# Altium project PICR22-team-Teletupsud.PrjPcb
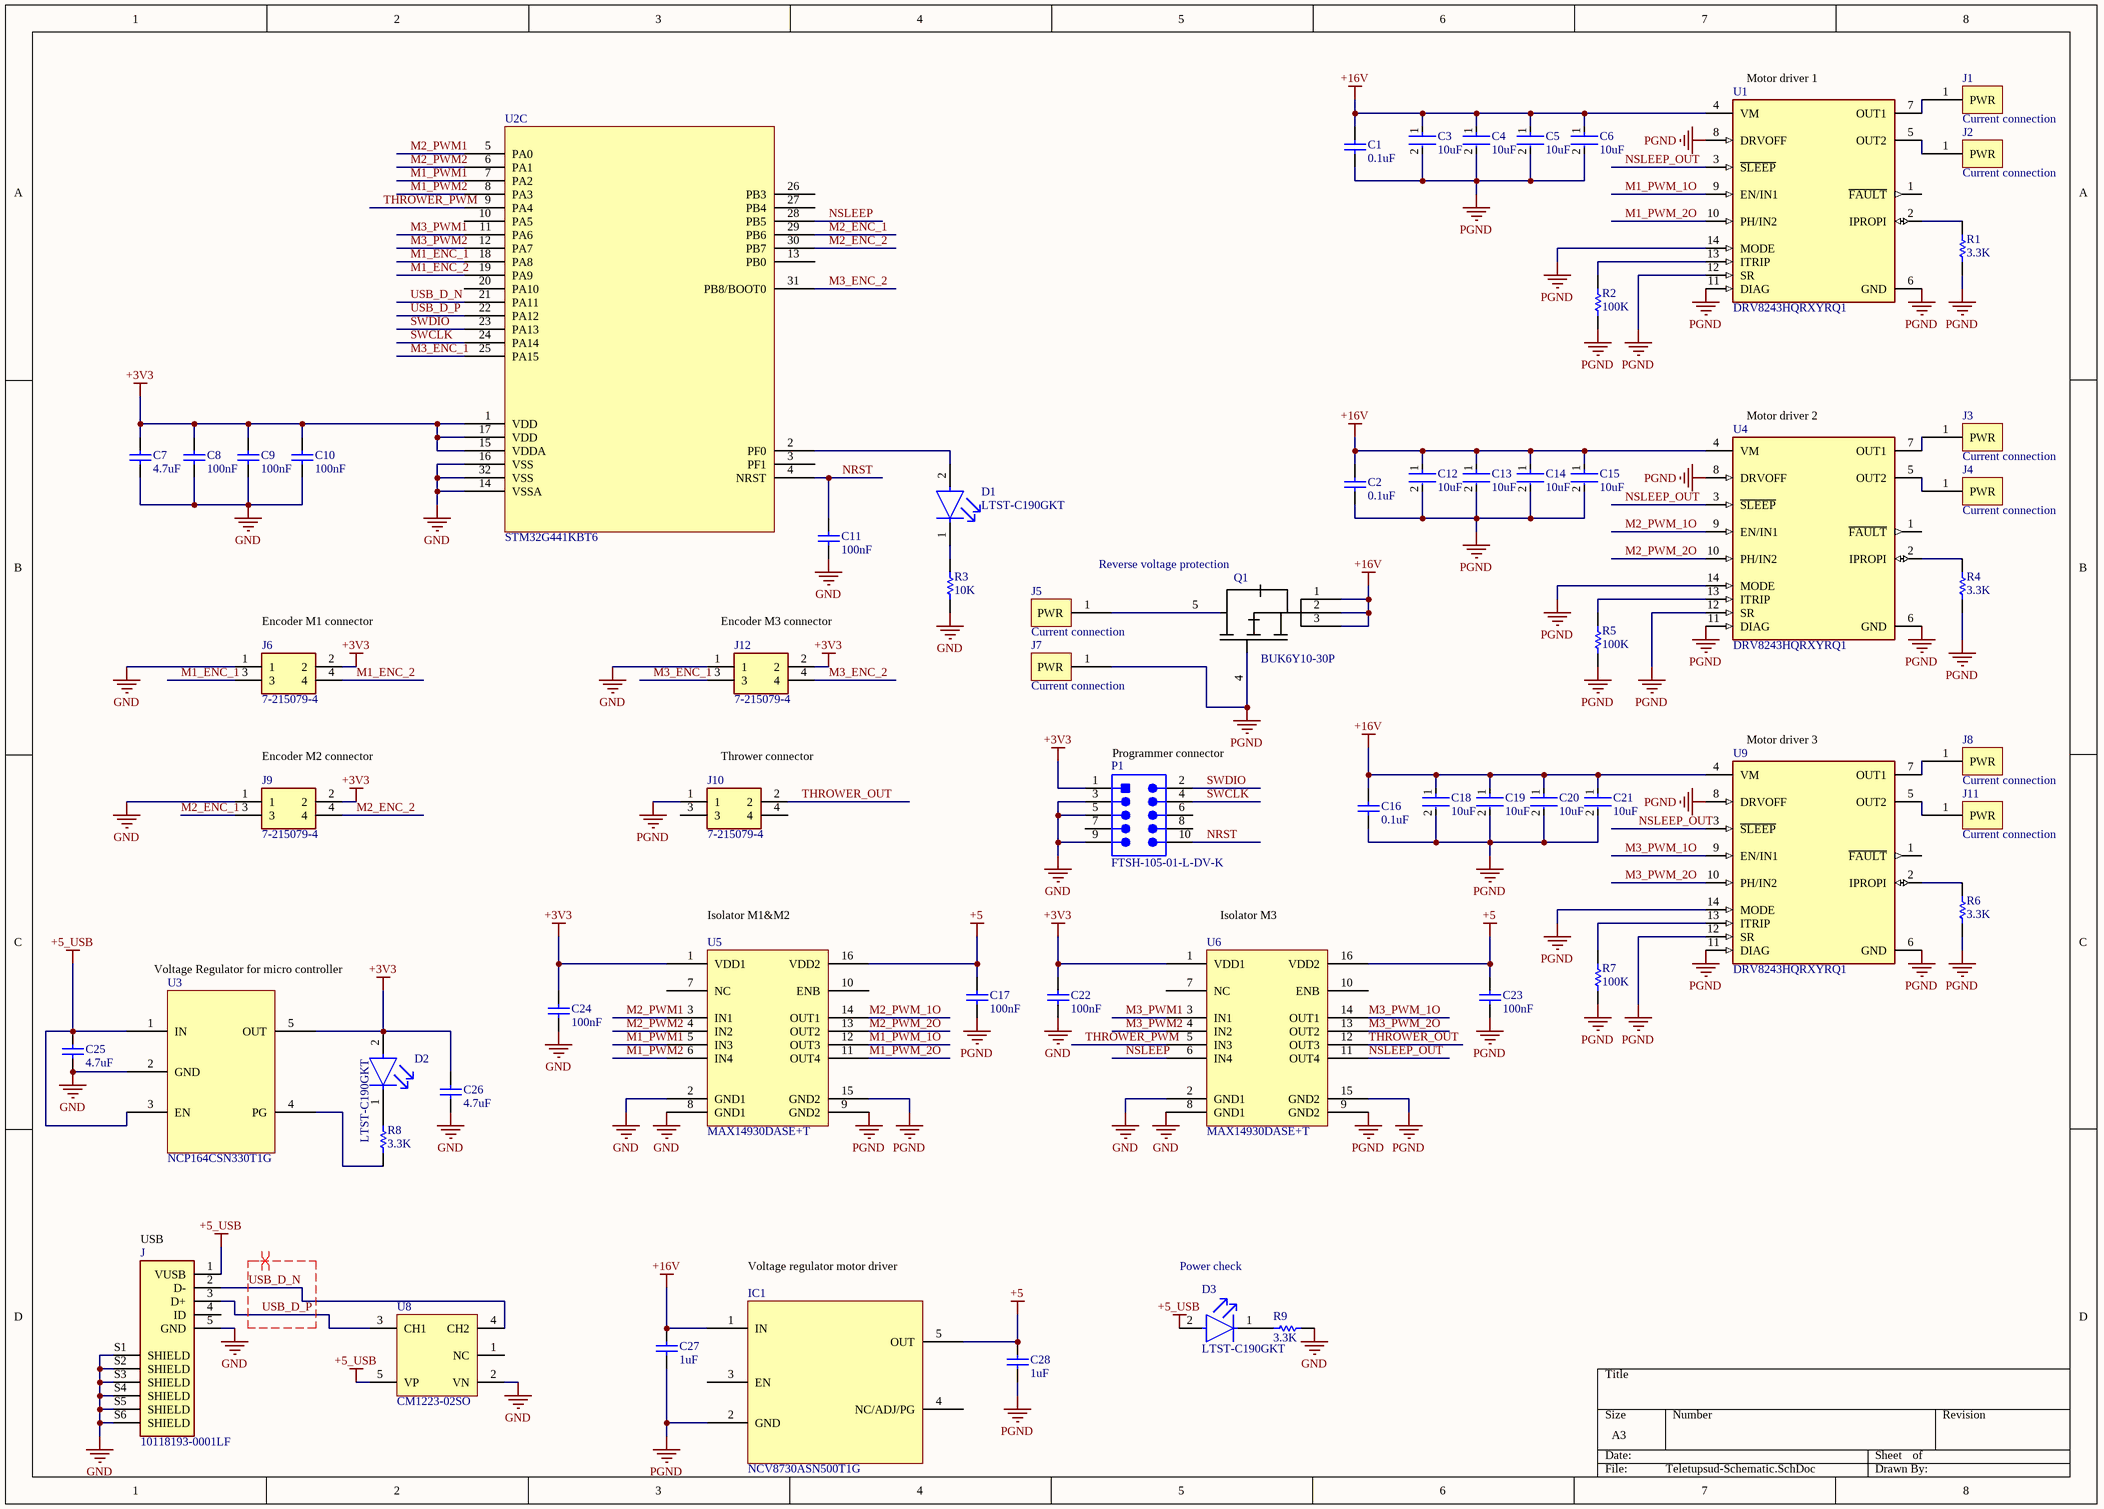
[diagram p0: Teletupsud-Schematic.SchDoc]
1 sheet, 64 parts. Net scope: global (net labels, ports and power ports of the same name join across sheets).

## Sheet Teletupsud-Schematic.SchDoc
size A3; SheetNumber: 1; SheetTotal: 1

### Parts
C1  0.1uF  [CAPC1608X90X35ML10T15]
C2  0.1uF  [CAPC1608X90X35ML10T15]
C3  10uF  [FP-GRM21B-0_15-IPC_A]
C4  10uF  [FP-GRM21B-0_15-IPC_A]
C5  10uF  [FP-GRM21B-0_15-IPC_A]
C6  10uF  [FP-GRM21B-0_15-IPC_A]
C7  4.7uF  [CAPC1608X90X35ML10T15]
C8  100nF  [CAPC1608X90X35ML10T15]
C9  100nF  [CAPC1608X90X35ML10T15]
C10  100nF  [CAPC1608X90X35ML10T15]
C11  100nF  [CAPC1608X90X35ML10T15]
C12  10uF  [FP-GRM21B-0_15-IPC_A]
C13  10uF  [FP-GRM21B-0_15-IPC_A]
C14  10uF  [FP-GRM21B-0_15-IPC_A]
C15  10uF  [FP-GRM21B-0_15-IPC_A]
C16  0.1uF  [CAPC1608X90X35ML10T15]
C17  100nF  [CAPC1608X90X35ML10T15]
C18  10uF  [FP-GRM21B-0_15-IPC_A]
C19  10uF  [FP-GRM21B-0_15-IPC_A]
C20  10uF  [FP-GRM21B-0_15-IPC_A]
C21  10uF  [FP-GRM21B-0_15-IPC_A]
C22  100nF  [CAPC1608X90X35ML10T15]
C23  100nF  [CAPC1608X90X35ML10T15]
C24  100nF  [CAPC1608X90X35ML10T15]
C25  4.7uF  [CAPC1608X90X35ML10T15]
C26  4.7uF  [CAPC1608X90X35ML10T15]
C27  1uF  [CAPC1608X90X35ML10T15]
C28  1uF  [CAPC1608X90X35ML10T15]
D1  LTST-C190GKT  [FP-LTST-C190GKT-MFG]
D2  LTST-C190GKT  [FP-LTST-C190GKT-MFG]
D3  LTST-C190GKT  [FP-LTST-C190GKT-MFG]
IC1  NCV8730ASN500T1G  [SOP95P275X110-5N]
J  10118193-0001LF  [FCI_10118193-0001LF]
J1  Current connection  [New footprint 1]
J2  Current connection  [New footprint 1]
J3  Current connection  [New footprint 1]
J4  Current connection  [New footprint 1]
J5  Current connection  [New footprint 1]
J6  7-215079-4  [TE_7-215079-4]
J7  Current connection  [New footprint 1]
J8  Current connection  [New footprint 1]
J9  7-215079-4  [TE_7-215079-4]
J10  7-215079-4  [TE_7-215079-4]
J11  Current connection  [New footprint 1]
J12  7-215079-4  [TE_7-215079-4]
P1  FTSH-105-01-L-DV-K  [SMTC-FTSH-105-01-L-DV-K_V]
Q1  BUK6Y10-30P  [TO127P600X120-5N]
R1  3.3K  [RESC1609X50X30NL8T20]
R2  100K  [RESC1609X50X30NL8T20]
R3  10K  [RESC1609X50X30NL8T20]
R4  3.3K  [RESC1609X50X30NL8T20]
R5  100K  [RESC1609X50X30NL8T20]
R6  3.3K  [RESC1609X50X30NL8T20]
R7  100K  [RESC1609X50X30NL8T20]
R8  3.3K  [RESC1609X50X30NL8T20]
R9  3.3K  [RESC1609X50X30NL8T20]
U1  DRV8243HQRXYRQ1  [FP-RXY0014A-MFG]
U2  STM32G441KBT6  [QFP32_STM32]  (part C of 3)
U3  NCP164CSN330T1G  [SOP95P275X110-5N]
U4  DRV8243HQRXYRQ1  [FP-RXY0014A-MFG]
U5  MAX14930DASE+T  [SOIC127P600X175-16N]
U6  MAX14930DASE+T  [SOIC127P600X175-16N]
U8  CM1223-02SO  [ONSC-SOT23-5-527AH-01_L]
U9  DRV8243HQRXYRQ1  [FP-RXY0014A-MFG]

### Nets
+3V3: C7.2 C8.2 C9.2 C10.2 C22.2 C24.2 C26.2 D2.2(A) J6.2 J9.2 J12.2 P1.1 U2.1(VDD) U2.15(VDDA) U2.17(VDD) U3.5(OUT) U5.1(VDD1) U6.1(VDD1)
+5: C17.2 C23.2 C28.2 IC1.5(OUT) U5.16(VDD2) U6.16(VDD2)
+5_USB: C25.2 D3.2(A) J.1(VUSB) U3.1(IN) U3.3(EN) U8.5(VP)
+16V: C1.2 C2.2 C3.1 C4.1 C5.1 C6.1 C12.1 C13.1 C14.1 C15.1 C16.2 C18.1 C19.1 C20.1 C21.1 C27.2 IC1.1(IN) Q1.1 Q1.2 Q1.3 U1.4(VM) U4.4(VM) U9.4(VM)
GND: C7.1 C8.1 C9.1 C10.1 C11.1 C22.1 C24.1 C25.1 C26.1 J.5(GND) J.S1(SHIELD) J.S2(SHIELD) J.S3(SHIELD) J.S4(SHIELD) J.S5(SHIELD) J.S6(SHIELD) J6.1 J9.1 J12.1 P1.3 P1.5 P1.9 R3.1 R9.2 U2.14(VSSA) U2.16(VSS) U2.32(VSS) U3.2(GND) U5.2(GND1) U5.8(GND1) U6.2(GND1) U6.8(GND1) U8.2(VN)
PGND: C1.1 C2.1 C3.2 C4.2 C5.2 C6.2 C12.2 C13.2 C14.2 C15.2 C16.1 C17.1 C18.2 C19.2 C20.2 C21.2 C23.1 C27.1 C28.1 IC1.2(GND) J7.1(PWR) J10.1 Q1.4 R1.1 R2.1 R4.1 R5.1 R6.1 R7.1 U1.6(GND) U1.8(DRVOFF) U1.11(DIAG) U1.12(SR) U1.14(MODE) U4.6(GND) U4.8(DRVOFF) U4.11(DIAG) U4.12(SR) U4.14(MODE) U5.9(GND2) U5.15(GND2) U6.9(GND2) U6.15(GND2) U9.6(GND) U9.8(DRVOFF) U9.11(DIAG) U9.12(SR) U9.14(MODE)
M1_ENC_1: J6.3 U2.18(PA8)
M1_ENC_2: J6.4 U2.19(PA9)
M1_PWM1: U2.7(PA2) U5.5(IN3)
M1_PWM2: U2.8(PA3) U5.6(IN4)
M1_PWM_1O: U1.9(EN/IN1) U5.12(OUT3)
M1_PWM_2O: U1.10(PH/IN2) U5.11(OUT4)
M2_ENC_1: J9.3 U2.29(PB6)
M2_ENC_2: J9.4 U2.30(PB7)
M2_PWM1: U2.5(PA0) U5.3(IN1)
M2_PWM2: U2.6(PA1) U5.4(IN2)
M2_PWM_1O: U4.9(EN/IN1) U5.14(OUT1)
M2_PWM_2O: U4.10(PH/IN2) U5.13(OUT2)
M3_ENC_1: J12.3 U2.25(PA15)
M3_ENC_2: J12.4 U2.31(PB8/BOOT0)
M3_PWM1: U2.11(PA6) U6.3(IN1)
M3_PWM2: U2.12(PA7) U6.4(IN2)
M3_PWM_1O: U6.14(OUT1) U9.9(EN/IN1)
M3_PWM_2O: U6.13(OUT2) U9.10(PH/IN2)
NRST: C11.2 P1.10 U2.4(NRST)
NSLEEP: U2.28(PB5) U6.6(IN4)
NSLEEP_OUT: U1.3(~{SLEEP}) U4.3(~{SLEEP}) U6.11(OUT4) U9.3(~{SLEEP})
SWCLK: P1.4 U2.24(PA14)
SWDIO: P1.2 U2.23(PA13)
THROWER_OUT: J10.2 U6.12(OUT3)
THROWER_PWM: U2.9(PA4) U6.5(IN3)
USB_D_N: J.2(D-) U2.21(PA11) U8.4(CH2)
USB_D_P: J.3(D+) U2.22(PA12) U8.3(CH1)
NetD1_1: D1.1(C) R3.2
NetD1_2: D1.2(A) U2.2(PF0)
NetD2_1: D2.1(C) R8.2
NetD3_1: D3.1(C) R9.1
NetJ1_1: J1.1(PWR) U1.7(OUT1)
NetJ2_1: J2.1(PWR) U1.5(OUT2)
NetJ3_1: J3.1(PWR) U4.7(OUT1)
NetJ4_1: J4.1(PWR) U4.5(OUT2)
NetJ5_1: J5.1(PWR) Q1.5
NetJ8_1: J8.1(PWR) U9.7(OUT1)
NetJ11_1: J11.1(PWR) U9.5(OUT2)
NetR1_2: R1.2 U1.2(IPROPI)
NetR2_2: R2.2 U1.13(ITRIP)
NetR4_2: R4.2 U4.2(IPROPI)
NetR5_2: R5.2 U4.13(ITRIP)
NetR6_2: R6.2 U9.2(IPROPI)
NetR7_2: R7.2 U9.13(ITRIP)
NetR8_1: R8.1 U3.4(PG)

Not connected (* = marked no-connect by the designer): IC1 3(EN) 4(NC/ADJ/PG); J 4(ID); J10 3 4; P1 6 7 8; U1 1(~{FAULT}); U2 3(PF1) 10(PA5) 13(PB0) 20(PA10) 26(PB3) 27(PB4); U4 1(~{FAULT}); U5 7(NC) 10(ENB); U6 7(NC) 10(ENB); U8 1(NC); U9 1(~{FAULT})

### Layout directives
differential pair; differential pair class USB: USB_D_N, USB_D_P

### Notes on the sheet
- (near U1) Motor driver 1
- (near U4) Motor driver 2
- (near Q1) Reverse voltage protection
- (near J6) Encoder M1 connector
- (near J12) Encoder M3 connector
- (near J9) Encoder M2 connector
- (near J10) Thrower connector
- (near P1) Programmer connector
- (near U9) Motor driver 3
- (near U5) Isolator M1&M2
- (near U6) Isolator M3
- Voltage Regulator for micro controller
- (near J) USB
- Voltage regulator motor driver
- Power check

### Library data of the parts
C1 C2 C7-C11 C16 C17 C22-C28 = CMP-2000-04945-1: Chip Capacitor, 22 pF, +/- 5%, 50 V, -55 to 125 degC, 0603 (1608 Metric), RoHS, Tape and Reel; Manufacturer: Murata; Capacitance: 22pF; Rated Voltage: 50V; Dielectric: C0G; Manufacturer URL: http://www.murata.com/; Datasheet Version: Jul-06; Package Reference: 603; Tolerance (%): ±5%; Case Size/Dimension: 0603; Package Description: 2-Pin Surface Mount Device, Body 1.6 x 0.8 mm; Datasheet URL: https://datasheet.ciiva.com/11786/0900766b807a1cab-11786398.pdf
C3-C6 C12-C15 C18-C21 = CMP-00007-1: CAP CER 10UF 25V X5R 0805; Material: Ceramic; Tolerance: 10%; Reach SVHC Compliant: Yes; Construction: Flat; Mount: Surface Mount; Case Code (Metric): 2012; Capacitance: 10uF; Voltage Rating: 25V; Voltage Rating (DC): 25V; Lead Free: Lead Free; Radiation Hardening: No; Packaging: Tape and Reel; Case/Package: 0805; Depth: 1.25mm; Case Code (Imperial): 0805; Voltage: 25V; Package Quantity: 1; Thickness: 0.053inch; Height: 1.25mm; Dielectric: X5R; Termination: SMD/SMT; RoHS Compliant: Yes; Length: 2mm; Width: 0.049inch; Series: GRM; Max Operating Temperature: 85°C; Min Operating Temperature: -55°C
D1 D2 = CMP-00006-1: LED Uni-Color Green 565nm 2-Pin Chip LED T/R; Forward Current: 30mA; Luminous Intensity: 6mcd; Power Rating: 100mW; Lens Size: 0.8mm; Lens Style: Flat,Diffused,Colorless,Rectangular,Clear; Voltage: 2V; Dominant Wavelength: 569nm; Forward Voltage: 2.1V; Lens Transparency: Clear; Number of Elements: 1; Test Current: 10mA; Reverse Voltage: 5V; Lens Color: Colorless; Viewing Angle: 130°; Color: Green; Radiation Hardening: No; Length: 1.6mm; Min Operating Temperature: -55°C; Series: -; Case Code (Imperial): 0603; Lead Free: Lead Free; Mount: Surface Mount; Wavelength: 565nm; Illumination Color: Green; Power Dissipation: 100mW; RoHS Compliant: Yes; Width: 0.8mm; Number of Pins: 2; Depth: 0.8mm; Packaging: Tape and Reel; Max Operating Temperature: 85°C; Package Quantity: 1; Case/Package: 0603; Case Code (Metric): 1608; Height: 0.9mm; Number of LEDs: 1
D3 = CMP-22017-000005-2: LED GREEN CLEAR CHIP SMD; Dominant Wavelength: 569nm; Reverse Voltage: 5V; Lens Color: Colorless; Viewing Angle: 130°; Voltage: 2V; Forward Current: 30mA; Power Dissipation: 100mW; Luminous Intensity: 6mcd; Number of LEDs: 1; Forward Voltage: 2.1V; Wavelength: 565nm; Test Current: 10mA; Min Operating Temperature: -55°C; Lens Style: Clear; Mount: Surface Mount; Width: 0.8mm; Packaging: Tape and Reel; Lens Transparency: Clear; Case Code (Metric): 1608; Depth: 0.8mm; Case Code (Imperial): 0603; Case/Package: 0603; Number of Pins: 2; Max Operating Temperature: 85°C; Lead Free: Lead Free; Number of Elements: 1; Length: 1.6mm; Height: 0.8mm; Package Quantity: 1; Power Rating: 100mW; Radiation Hardening: No; Illumination Color: Green; Color: Green
IC1 = CMP-00000-4
J = CMP-005-000000-4: USB - micro B USB 2.0 Receptacle Connector 5 Position Surface Mount, Right Angle; Through Hole; MF: Amphenol ICC; Pin Count: 11; Value: *; Availability: Unavailable; Component Type: Standard; Price: None; SnapEDA_Link: https://www.snapeda.com/parts/10118193-0001LF/Amphenol%20FCI/view-part/2758989/?ref=snap; Source: SnapEDAsch.SchLib; Package: None; MP: 10118193-0001LF; Design Item ID: 10118193-0001LF
J1-J5 J7 J8 J11 = CMP-00009-2
J6 J9 J10 J12 = CMP-003-000000-1: Micro-MaTch 4 Position 1.27 mm Pitch Vertical Female-on-Board Connector; MF: TE Connectivity; Package: SMD-6; Source: 7-215079-4.SchLib; Value: *; MP: 7-215079-4; Availability: Unavailable; Price: None; Design Item ID: 7-215079-4; Component Type: Standard; Pin Count: 4; SnapEDA_Link: https://www.snapeda.com/parts/7-215079-4/TE%20Connectivity%20AMP%20Connectors/view-part/453401/?ref=snap
P1 = CMP-2000-05353-1: Male Header, Pitch 1.27 mm, 2 x 5 Position, Height 6.25 mm; Manufacturer: Samtec; Pitch: 0.050"(1.27mm); Other Names: Q3937619; Number of Positions: 10; Mating Products: SFMC-105-L2-S-D-TR-ND / -CONN.05"SURFACE10POSSMT / FLE-105-01-G-DV-TR-ND / -CONNSKT1.27MM10POSDUALSMD / FLE-105-01-G-DV-A-P-ND / -CONNSKT1.27MM10POSDUALSMD / FLE-105-01-G-DV-A-ND / -CONNSKT1.27MM10POSDUALSMD / CLP-105-02-G-D-P-TR-ND / -CONNRCPT10POSDUAL.05"SMD / SAM1155-05-ND / -CONNRCPT10POSDUAL.05"SMD / SAM1154-05-ND / -CONNRCPT10POSDUAL.05"SMD / SAM1153-05-ND / -CONNRCPT10POSDUAL.05"SMD / SAM1226-05-ND / -CONNRCPT.05"10POSDUALSMD; Number of Positions Loaded: All; Connector Type: Header,Unshrouded; Product Training Modules: Board-to-BoardConnectors; Datasheet Version: Rev. ET, 10/1995; Number of Rows: 2; Standard Package: 1; Package Description: Male Header, Pitch 1.27 mm, 2 x 5 Position, Height 5.97 mm, Tail Length 4.32 mm; Contact Finish Thickness: 10µin(0.25µm); Series: FTSH; Termination: Solder; Contact Type: MalePin; Color: Black; Package Reference: FTSH-105-01-L-DV-K; Family: RectangularConnectors-Headers,MalePins; Package URL: http://suddendocs.samtec.com/prints/ftsh-1xx-xx-xxx-dv-xxx-footprint.pdf; Packaging: Tube; Mounting Type: SurfaceMount; Category: Connectors,Interconnects; Datasheet URL: http://suddendocs.samtec.com/prints/ftsh-1xx-xx-xxx-dv-xxx-mkt.pdf; Row Spacing: 0.050"(1.27mm); Manufacturer URL: http://www.samtec.com/; Contact Mating Length: 0.120"(3.05mm); Contact Finish: Gold
Q1 = CMP-00003-1
R1-R9 = CMP-2000-03816-5: Chip Resistor, 0 Ohm, Jumper, 100 mW, -55 to 155 degC, 0603 (1608 Metric), RoHS, Tape and Reel; Manufacturer: Vishay Semiconductor; Voltage Rating: 75 V; Package Quantity: 5000; DatasheetVersion: 06/2012; Min Operating Temperature: -55 degC; ComponentLink1URL: http://www.vishay.com/; Mounting Technology: Surface Mount; Height: 0.45 mm; ComponentLink1Description: Manufacturer URL; REACH SVHC: Unknown; PackageReference: 0603; Packaging: Tape and Reel; Max Operating Temperature: 155 degC; Mount: Surface Mount; ComponentLink2Description: Datasheet; PackageDescription: 2-Pin Surface Mount Device, Body 1.575 x 0.85 mm; Length: 1.55 mm; ComponentLink2URL: http://www.vishay.com/docs/20035/dcrcwe3.pdf; Pins: 2; RoHSCompliant: true
U1 U4 U9 = CMP-00004-1: Automotive 40-V, 12-A H-Bridge driver with integrated current sensing and feedback 14-VQFN-HR -40 to 125
U2 = CMP-00001-4
U3 = CMP-00002-4
U5 U6 = CMP-00005-3: Digital Isolator, 4Ch, -40 To 125Deg C Rohs Compliant: Yes; Data Rate: 1Mbps; Pulse Width Distortion (PWD): 4.5ns; Channel Type: Unidirectional; Number of Channels: 4; Propagation Delay: 55.3ns; Isolated Power: No; Packaging: Rail/Tube; RoHS Compliant: Yes; Series: -; Type: General Purpose; Case/Package: SOIC; Max Operating Temperature: 125°C; Min Operating Temperature: -40°C
U8 = CMP-1063-00173-1: Industry First Low Capacitance ESD Protection Arrays with Backdrive Protection, 5-Pin SOT-23, Pb-Free, Tape and Reel; Manufacturer: On Semiconductor; Direction: Unidirectional; PPK Max (W): 0.225; C Max (pF): 1.5; Number of Lines: 2; ComponentLink1Description: Manufacturer URL; PackageReference: SOT23-5-527AH-01; ComponentLink3URL: http://www.onsemi.com/pub_link/Collateral/527AH.PDF; ComponentLink1URL: http://www.onsemi.com/; PackageDescription: 5-Pin Small Outline Transistor, Body 2.9 x 1.6 mm, Pitch 0.95 mm; ComponentLink2URL: http://www.onsemi.com/pub_link/Collateral/CM1223-D.PDF; PackageVersion: Rev. O, 12/2008; ComponentLink3Description: Package Specification; PartNumber: CM1223-02SO; DatasheetVersion: Rev. 6; RoHS: Pb-Free; Code_JEDEC: MO-178; ComponentLink2Description: Datasheet; Packing: Tape and Reel; Mounting Technology: Surface Mount